# EasyEDA Pro project ProPrj_IoT House_2026-04-28.epro, schematic Schematic2
Board Name: Buzzer_Module; Create Date: 2026-01-06; Page Name: P1; Project Name: IoT House; Schematic Name: Schematic2; Update Date: 2026-01-17; Company: EasyEDA.com; Page Size: A4; Version: V1.0
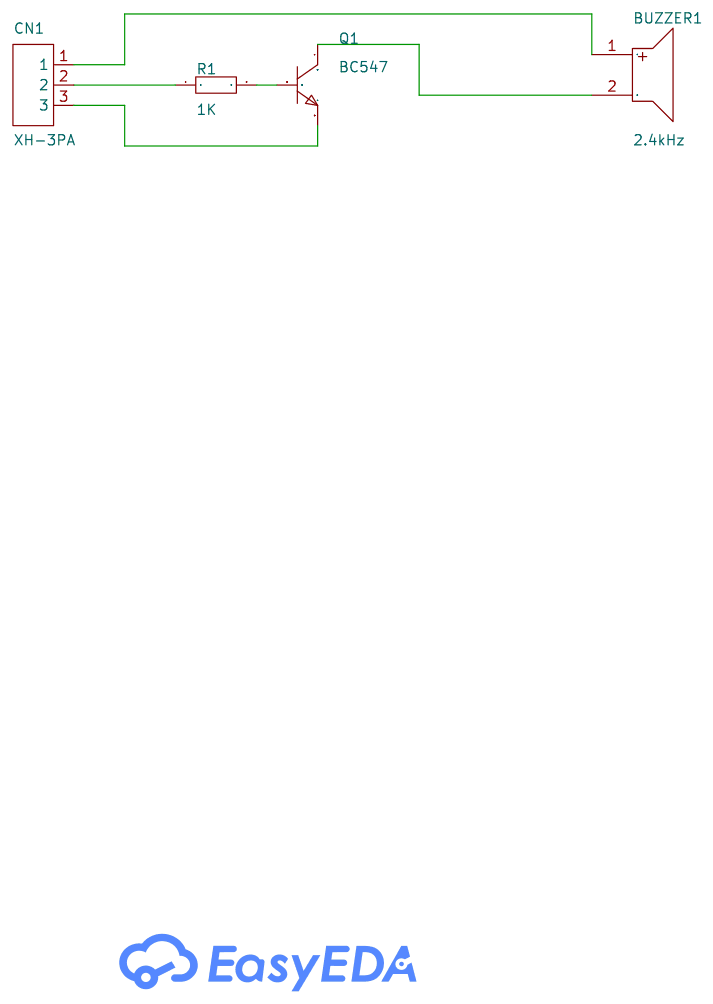
[diagram p1: schematic sheet]

## Parts
BUZZER1  2.4kHz  [BUZ-TH_BD12.0-P7.60-D0.6-FD]
CN1  XH-3PA  [CONN-TH_3P-P2.50_ZHOURI_XH-3PA]
Q1  BC547  [TO-92-3_L4.9-W3.7-P1.27-L]
R1  1K  [RES-TH_BD1.8-L3.2-P7.20-D0.4]

## Library data of the parts
BUZZER1 = TMB12A12: Driver Circuitry:Active (Built-in Driver Circuit) Technology:Electromagnetic Type Voltage - Supply:8V~15V Voltage - Supply:8V~15V Frequency:2.4kHz Current Consumption:30mA Sound Pressure Level(SPL):88dB Diameter(φD):12mm Length:- Width:- Height:9.5mm Oper; LCSC Part Name: 有源电磁式蜂鸣器; Supplier Part: C781861; Manufacturer: YUEXIN(悦馨); Supplier Footprint: 插件,D=12mm; JLCPCB Part Class: Extended Part; Datasheet: https://atta.szlcsc.com/upload/public/pdf/source/20200927/C781859_CEC7B7F6A9D62F380D126441DF0F265C.pdf; Supplier: LCSC; Driver Circuitry: Active (Built-in Driver Circuit); Technology: Electromagnetic Type; Voltage - Supply: 8V~15V; Current Consumption: 30mA; Sound Pressure Level(SPL): 88dB; Diameter(φD): 12mm; Height: 9.5mm; Operating Temperature: -30℃~+85℃
CN1 = XH-3PA: Pins Structure:1x3P Pitch:2.5mm Mounting Type:Through Hole Number of Pins:3P Number of Rows:1 Number of PINs Per Row:3 Current Rating:3A Operating Temperature:-25℃~+85℃ Operating Temperature:-25℃~+85℃ Voltage Rating:250V Plastic Material:PA66 Z-Height of; LCSC Part Name: 1x3P 间距:2.5mm 直插; Supplier Part: C5258884; Manufacturer: ZHOURI(洲日); Supplier Footprint: 插件,P=2.5mm; JLCPCB Part Class: Extended Part; Datasheet: https://item.szlcsc.com/datasheet/XH-3PA/5978915.html; Supplier: LCSC; Pins Structure: 1x3P; Pitch: 2.5mm; Mounting Type: Through Hole; Number of Pins: 3P; Number of Rows: 1; Number of PINs Per Row: 3; Current Rating: 3A; Operating Temperature: -25℃~+85℃; Voltage Rating: 250V; Plastic Material: PA66; Z-Height of the Board: 7mm; X-Length of Bottom Edge on Board (Spacing Line): 10mm; Y-Width of Bottom Edge on Board: 5.7mm
Q1 = BC547: type:NPN Current - Collector(Ic):100mA Collector - Emitter Voltage VCEO:45V Pd - Power Dissipation:625mW DC Current Gain:800@5V,2mA DC Current Gain:800@5V,2mA Transition frequency(fT):150MHz Current - Collector Cutoff:100nA Vce Saturation(VCE(sat)):300mV@; Supplier Part: C47089404; Manufacturer: CJ(江苏长电/长晶); Supplier Footprint: TO-92; JLCPCB Part Class: Extended Part; Datasheet: https://item.szlcsc.com/datasheet/BC547/49277194.html; Supplier: LCSC; type: NPN; Current - Collector(Ic): 100mA; Collector - Emitter Voltage VCEO: 45V; Pd - Power Dissipation: 625mW; DC Current Gain: 800@5V,2mA; Transition frequency(fT): 150MHz; Current - Collector Cutoff: 100nA; Vce Saturation(VCE(sat)): 300mV@100mA,5mA; Operating Temperature: -55℃~+150℃; Emitter-Base Voltage(Vebo): 6V; Number: 1 NPN
R1 = Res_AXIAL-1/8W: Supplier Footprint: Through

## Nets
Net-(BUZZER1-1): BUZZER1.1 CN1.1
Net-(BUZZER1-2): BUZZER1.2 Q1.1(C)
Net-(CN1-2): CN1.2 R1.1
Net-(CN1-3): CN1.3 Q1.3(E)
Net-(Q1-2): Q1.2(B) R1.2
